# Altium project 3PH-ACIM-DRIVER.PrjPcb
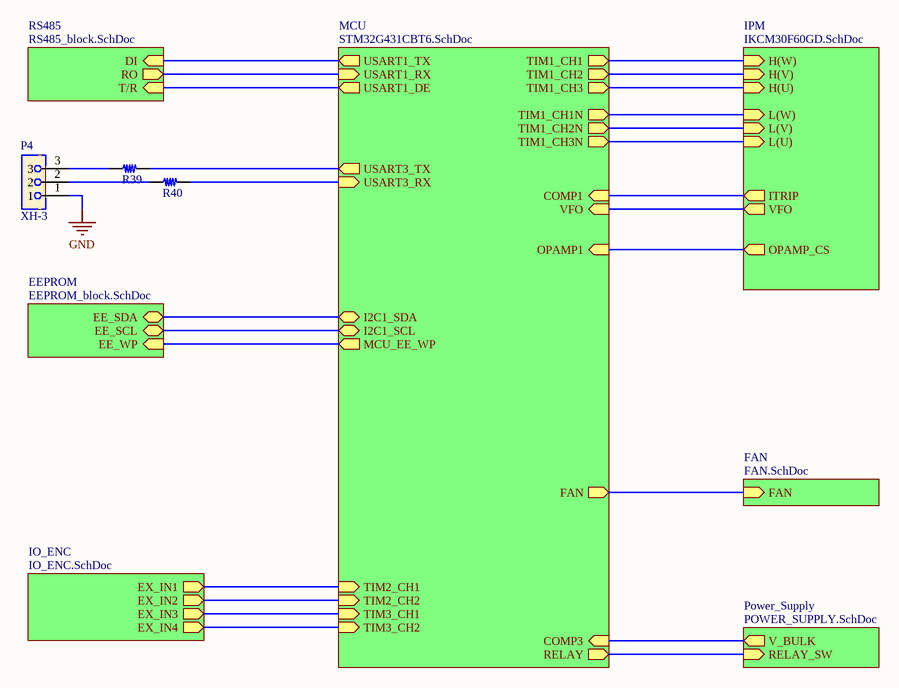
[diagram p0: MAIN.SchDoc]
8 sheets, 175 parts. Net scope: hierarchical (ports join the sheet entries above them; power ports are global).
Board file: 3PH-ACIM-DRIVER.PcbDoc
Sheets:
  MAIN.SchDoc
    IPM = IKCM30F60GD.SchDoc
    MCU = STM32G431CBT6.SchDoc
    Power_Supply = POWER_SUPPLY.SchDoc
    RS485 = RS485_block.SchDoc
    EEPROM = EEPROM_block.SchDoc
    FAN = FAN.SchDoc
    IO_ENC = IO_ENC.SchDoc

## Sheet MAIN.SchDoc
size 381 x 254 mm; SheetNumber: 1; SheetTotal: 8

### Parts
P4  XH-3  [XH-3]
R39  RES_SMD  [R 0603]  (value not drawn)
R40  RES_SMD  [R 0603]  (value not drawn)

### Sub-sheets
EEPROM = EEPROM_block.SchDoc: EE_SDA (bidir), EE_SCL (bidir), EE_WP (in)
FAN = FAN.SchDoc: FAN (in)
IO_ENC = IO_ENC.SchDoc: EX_IN1 (out), EX_IN2 (out), EX_IN3 (out), EX_IN4 (out)
IPM = IKCM30F60GD.SchDoc: H(U) (in), H(V) (in), H(W) (in), L(U) (in), L(V) (in), L(W) (in), VFO (out), OPAMP_CS (out), ITRIP (out)
MCU = STM32G431CBT6.SchDoc: TIM1_CH1 (out), TIM1_CH2 (out), TIM1_CH3 (out), TIM1_CH1N (out), TIM1_CH2N (out), TIM1_CH3N (out), USART1_TX (out), USART1_RX (in), VFO (in), COMP3 (in), OPAMP1 (in), RELAY (out), I2C1_SDA (bidir), I2C1_SCL (bidir), USART1_DE (out), TIM3_CH1 (in), TIM3_CH2 (in), TIM2_CH2 (in), TIM2_CH1 (in), FAN (out), MCU_EE_WP (out), COMP1 (in), USART3_TX (out), USART3_RX (in)
Power_Supply = POWER_SUPPLY.SchDoc: V_BULK (out), RELAY_SW (in)
RS485 = RS485_block.SchDoc: RO (out), DI (in), T/R (in)

### Nets
GND: P4.1
ITRIP: sheet IPM/ITRIP, sheet MCU/COMP1
SERIAL_N: sheet MCU/USART1_TX, sheet RS485/DI
SERIAL_P: sheet MCU/USART1_RX, sheet RS485/RO
NetC3_2: sheet IPM/OPAMP_CS, sheet MCU/OPAMP1
NetC19_2: sheet IPM/VFO, sheet MCU/VFO
NetC32_2: sheet MCU/COMP3, sheet Power_Supply/V_BULK
NetD6_1: sheet MCU/RELAY, sheet Power_Supply/RELAY_SW
NetD20_1: sheet MCU/FAN, sheet FAN/FAN
NetP4_2: P4.2 R40.1
NetP4_3: P4.3 R39.1
NetR12_1: sheet IPM/H(U), sheet MCU/TIM1_CH3
NetR13_1: sheet IPM/H(V), sheet MCU/TIM1_CH2
NetR14_1: sheet IPM/H(W), sheet MCU/TIM1_CH1
NetR15_1: sheet IPM/L(U), sheet MCU/TIM1_CH3N
NetR16_1: sheet IPM/L(V), sheet MCU/TIM1_CH2N
NetR17_1: sheet IPM/L(W), sheet MCU/TIM1_CH1N
NetR39_2: R39.2 ; sheet MCU/USART3_TX
NetR40_2: R40.2 ; sheet MCU/USART3_RX
NetR48_1: sheet MCU/USART1_DE, sheet RS485/T/R
NetR53_1: sheet MCU/MCU_EE_WP, sheet EEPROM/EE_WP
NetR54_1: sheet MCU/I2C1_SDA, sheet EEPROM/EE_SDA
NetR55_1: sheet MCU/I2C1_SCL, sheet EEPROM/EE_SCL
NetR62_1: sheet MCU/TIM2_CH1, sheet IO_ENC/EX_IN1
NetR65_1: sheet MCU/TIM2_CH2, sheet IO_ENC/EX_IN2
NetR66_1: sheet MCU/TIM3_CH1, sheet IO_ENC/EX_IN3
NetR69_1: sheet MCU/TIM3_CH2, sheet IO_ENC/EX_IN4

## Sheet IKCM30F60GD.SchDoc
size 762 x 381 mm; SheetNumber: 2; SheetTotal: 8
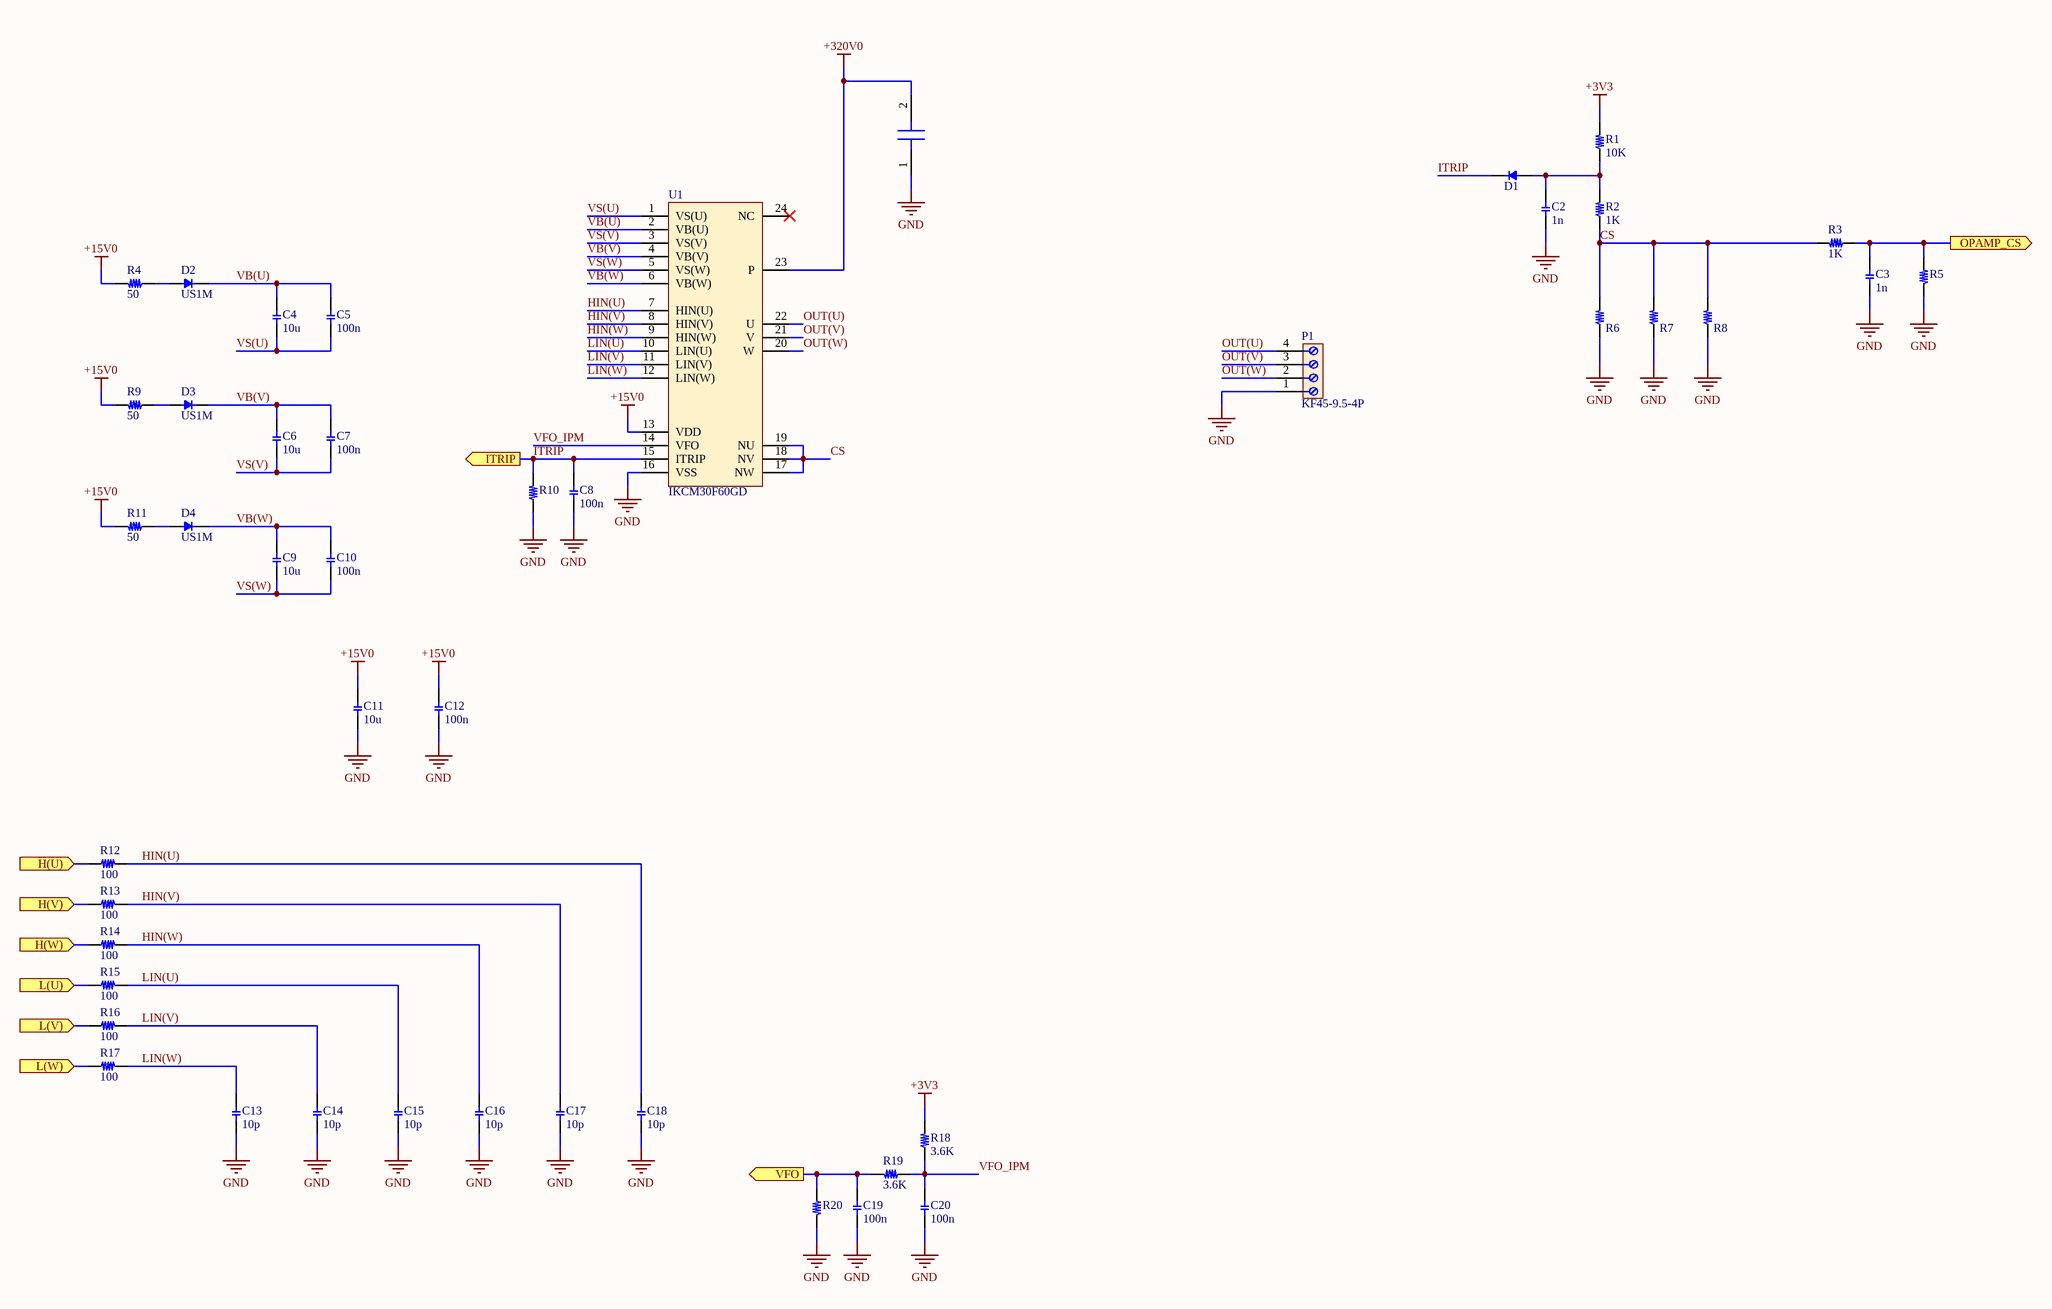
[diagram p1: IKCM30F60GD.SchDoc]

### Parts
C1  CAP  [C FILM 15mm]  (value not drawn)
C2  1n  [C 0603]
C3  1n  [C 0603]
C4  10u  [C 0603]
C5  100n  [C 0603]
C6  10u  [C 0603]
C7  100n  [C 0603]
C8  100n  [C 0603]
C9  10u  [C 0603]
C10  100n  [C 0603]
C11  10u  [C 0603]
C12  100n  [C 0603]
C13  10p  [C 0603]
C14  10p  [C 0603]
C15  10p  [C 0603]
C16  10p  [C 0603]
C17  10p  [C 0603]
C18  10p  [C 0603]
C19  100n  [C 0603]
C20  100n  [C 0603]
D1  DIOD_SMD  [D SOD-323]  (value not drawn)
D2  US1M  [DIOD_SMA]
D3  US1M  [DIOD_SMA]
D4  US1M  [DIOD_SMA]
P1  KF45-9.5-4P  [DG45C-B-04P-13]
R1  10K  [R 0603]
R2  1K  [R 0603]
R3  1K  [R 0603]
R4  50  [R 1206]
R5  1K  [R 0603]  (value not drawn)
R6  RES_SMD  [R 2512]  (value not drawn)
R7  RES_SMD  [R 2512]  (value not drawn)
R8  RES_SMD  [R 2512]  (value not drawn)
R9  50  [R 1206]
R10  1K  [R 0603]  (value not drawn)
R11  50  [R 1206]
R12  100  [R 0603]
R13  100  [R 0603]
R14  100  [R 0603]
R15  100  [R 0603]
R16  100  [R 0603]
R17  100  [R 0603]
R18  3.6K  [R 0603]
R19  3.6K  [R 0603]
R20  3.6K  [R 0603]  (value not drawn)
U1  IKCM30F60GD  [INF-CIPOS MINI]

### Ports
H(U) (in), H(V) (in), H(W) (in), ITRIP (out), L(U) (in), L(V) (in), L(W) (in), OPAMP_CS (out), VFO (out)

### Nets
+3V3: R1.2 R18.2
+15V0: C11.2 C12.2 R4.2 R9.2 R11.2 U1.13(VDD)
+320V0: C1.2 U1.23(P)
GND: C1.1 C2.1 C3.1 C8.1 C11.1 C12.1 C13.1 C14.1 C15.1 C16.1 C17.1 C18.1 C19.1 C20.1 P1.1 R5.2 R6.1 R7.1 R8.1 R10.1 R20.2 U1.16(VSS)
CS: R2.1 R3.2 R6.2 R7.2 R8.2 U1.17(NW) U1.18(NV) U1.19(NU)
HIN(U): C18.2 R12.2 U1.7(HIN(U))
HIN(V): C17.2 R13.2 U1.8(HIN(V))
HIN(W): C16.2 R14.2 U1.9(HIN(W))
ITRIP: C8.2 D1.2 R10.2 U1.15(ITRIP) ; port ITRIP
LIN(U): C15.2 R15.2 U1.10(LIN(U))
LIN(V): C14.2 R16.2 U1.11(LIN(V))
LIN(W): C13.2 R17.2 U1.12(LIN(W))
OUT(U): P1.4 U1.22(U)
OUT(V): P1.3 U1.21(V)
OUT(W): P1.2 U1.20(W)
VB(U): C4.2 C5.2 D2.2 U1.2(VB(U))
VB(V): C6.2 C7.2 D3.2 U1.4(VB(V))
VB(W): C9.2 C10.2 D4.2 U1.6(VB(W))
VFO_IPM: C20.2 R18.1 R19.1 U1.14(VFO)
VS(U): C4.1 C5.1 U1.1(VS(U))
VS(V): C6.1 C7.1 U1.3(VS(V))
VS(W): C9.1 C10.1 U1.5(VS(W))
NetC2_2: C2.2 D1.1 R1.1 R2.2
NetC3_2: C3.2 R3.1 R5.1 ; port OPAMP_CS
NetC19_2: C19.2 R19.2 R20.1 ; port VFO
NetD2_1: D2.1 R4.1
NetD3_1: D3.1 R9.1
NetD4_1: D4.1 R11.1
NetR12_1: R12.1 ; port H(U)
NetR13_1: R13.1 ; port H(V)
NetR14_1: R14.1 ; port H(W)
NetR15_1: R15.1 ; port L(U)
NetR16_1: R16.1 ; port L(V)
NetR17_1: R17.1 ; port L(W)

Not connected (* = marked no-connect by the designer): U1 24(NC)*

### Library data of the parts
C2-C20 = CAP_SMD
D2-D4 = DIOD_SMD
R1-R5 R9-R20 = RES_SMD

## Sheet STM32G431CBT6.SchDoc
size 762 x 381 mm; SheetNumber: 4; SheetTotal: 8
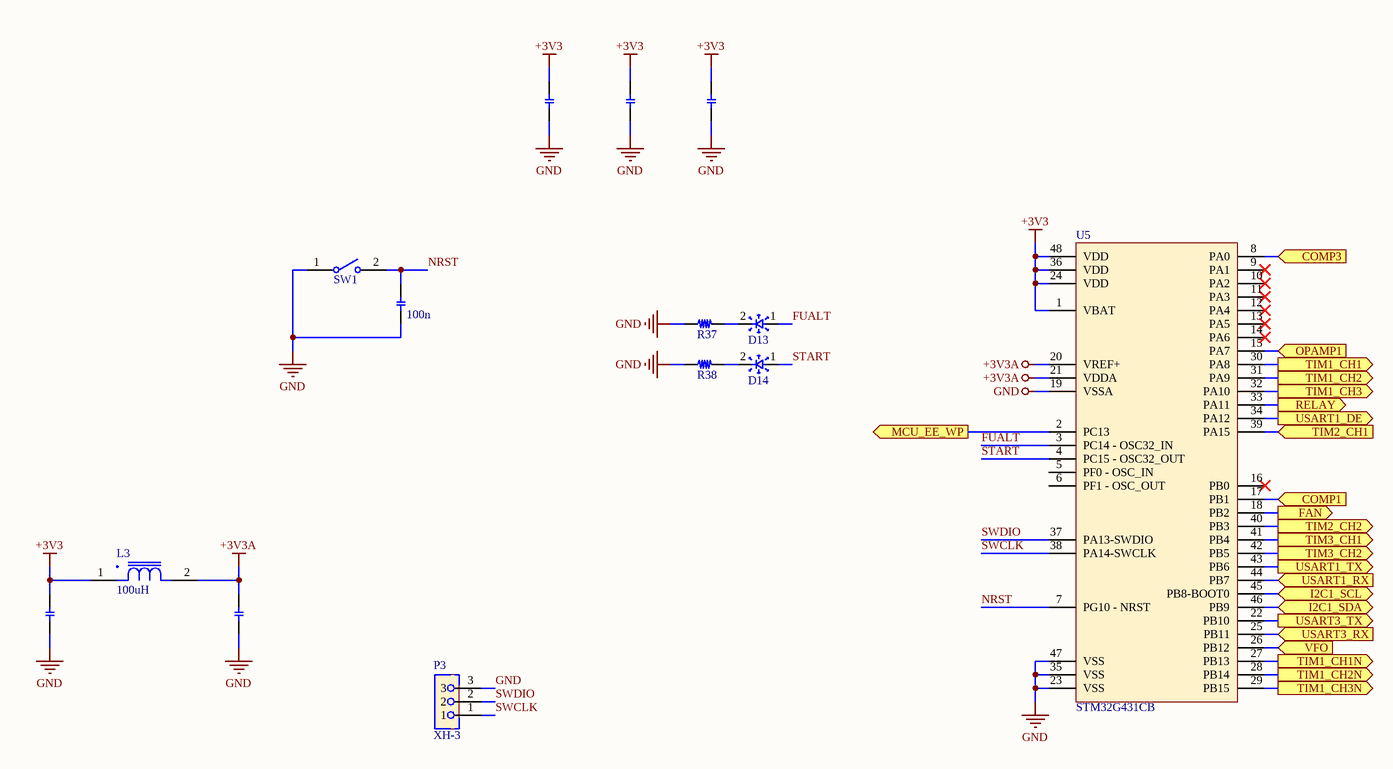
[diagram p2: STM32G431CBT6.SchDoc]

### Parts
C40  CAP_SMD  [C 0603]  (value not drawn)
C41  CAP_SMD  [C 0603]  (value not drawn)
C42  CAP_SMD  [C 0603]  (value not drawn)
C43  100n  [C 0603]
C44  CAP_SMD  [C 0603]  (value not drawn)
C45  CAP_SMD  [C 0603]  (value not drawn)
D13  LED_SMD  [D 0603]  (value not drawn)
D14  LED_SMD  [D 0603]  (value not drawn)
L3  100uH  [L 0805]
P3  XH-3  [XH-3]
R37  RES_SMD  [R 0603]  (value not drawn)
R38  RES_SMD  [R 0603]  (value not drawn)
SW1  434121043836  [WS-TASV_L6W3.5H4.3_4341x10438x6]  (value not drawn)
U5  STM32G431CB  [QFP-48]

### Ports
COMP1 (in), COMP3 (in), FAN (out), I2C1_SCL (bidir), I2C1_SDA (bidir), MCU_EE_WP (out), OPAMP1 (in), RELAY (out), TIM1_CH1 (out), TIM1_CH1N (out), TIM1_CH2 (out), TIM1_CH2N (out), TIM1_CH3 (out), TIM1_CH3N (out), TIM2_CH1 (in), TIM2_CH2 (out), TIM3_CH1 (out), TIM3_CH2 (out), USART1_DE (out), USART1_RX (in), USART1_TX (out), USART3_RX (in), USART3_TX (out), VFO (in)

### Nets
+3V3: C40.2 C41.2 C42.2 C44.2 L3.1 U5.1(VBAT) U5.24(VDD) U5.36(VDD) U5.48(VDD)
+3V3A: C45.2 L3.2 U5.20(VREF+) U5.21(VDDA)
GND: C40.1 C41.1 C42.1 C43.1 C44.1 C45.1 P3.3 R37.1 R38.1 SW1.1 U5.19(VSSA) U5.23(VSS) U5.35(VSS) U5.47(VSS)
FUALT: D13.1 U5.3(PC14_-_OSC32_IN)
ITRIP: U5.17(PB1) ; port COMP1
NRST: C43.2 SW1.2 U5.7(PG10_-_NRST)
SERIAL_N: U5.43(PB6) ; port USART1_TX
SERIAL_P: U5.44(PB7) ; port USART1_RX
START: D14.1 U5.4(PC15_-_OSC32_OUT)
SWCLK: P3.1 U5.38(PA14-SWCLK)
SWDIO: P3.2 U5.37(PA13-SWDIO)
NetC3_2: U5.15(PA7) ; port OPAMP1
NetC19_2: U5.26(PB12) ; port VFO
NetC32_2: U5.8(PA0) ; port COMP3
NetD6_1: U5.33(PA11) ; port RELAY
NetD13_2: D13.2 R37.2
NetD14_2: D14.2 R38.2
NetD20_1: U5.18(PB2) ; port FAN
NetR12_1: U5.32(PA10) ; port TIM1_CH3
NetR13_1: U5.31(PA9) ; port TIM1_CH2
NetR14_1: U5.30(PA8) ; port TIM1_CH1
NetR15_1: U5.29(PB15) ; port TIM1_CH3N
NetR16_1: U5.28(PB14) ; port TIM1_CH2N
NetR17_1: U5.27(PB13) ; port TIM1_CH1N
NetR39_2: U5.22(PB10) ; port USART3_TX
NetR40_2: U5.25(PB11) ; port USART3_RX
NetR48_1: U5.34(PA12) ; port USART1_DE
NetR53_1: U5.2(PC13) ; port MCU_EE_WP
NetR54_1: U5.46(PB9) ; port I2C1_SDA
NetR55_1: U5.45(PB8-BOOT0) ; port I2C1_SCL
NetR62_1: U5.39(PA15) ; port TIM2_CH1
NetR65_1: U5.40(PB3) ; port TIM2_CH2
NetR66_1: U5.41(PB4) ; port TIM3_CH1
NetR69_1: U5.42(PB5) ; port TIM3_CH2

Not connected (* = marked no-connect by the designer): U5 5(PF0_-_OSC_IN) 6(PF1_-_OSC_OUT) 9(PA1)* 10(PA2)* 11(PA3)* 12(PA4)* 13(PA5)* 14(PA6)* 16(PB0)*

### Library data of the parts
C43 = CAP_SMD
L3 = Inductor
SW1 = 434121043836: WS-TASV SMT Tact Switch, L6 x W3.5 x H4.3mm, 360g, SPST-NO, 12V, 50mA; Manufacturer: Wurth Elektronik; Washable: No; Manufacturer Part Number: 434121043836; Category: Tact Switches; Match Code: WS-TASV; ComponentLink1Description: Website Link; ComponentLink1URL: https://www.we-online.com/redexpert/article/434121043836?ad; ComponentLink2Description: Datasheet Link; ComponentLink2URL: https://www.we-online.com/redexpert/spec/434121043836?ad; Mount: Surface Mount; Operating Temperature Max: 85°C; Operating Temperature Min: -40°C; Packaging: Tape and Reel; Length: 6mm; Width: 3.5mm; Height: 4.3mm; Circuit: SPST-NO; Contact Material: Stainless Steel; Contact Plating: Silver; Operation Force: 360g; Rated Current: 50mA; Rated Voltage (DC): 12V; Terminal Material: Copper Alloy; Terminal Plating: Silver

## Sheet POWER_SUPPLY.SchDoc
size 762 x 381 mm; SheetNumber: 3; SheetTotal: 8; SPICEModelCacheBEUKSOBP: <root> / <DocumentId>BEUKSOBP</DocumentId> / <CacheFrame Number="0"> / <Model Name="865230657013_100uf" Kind="CKT"> / <Text>******* / .subckt 865230657013_100uF 1 2 / Rser 1 3 0.189 / Lser 2 4 5.72884434804354E-09 / C1 3 4 0.0001 / Rpar 3 4 1000000 / .ends 865230657013_100uF</Text> / </Model> / <Model Name="861011483001_47uf" Kind="CKT"> / <Text>***** / .subckt 861011483001_47uF 1 2 / Rser 1 3 0.592 / Lser 2 4 1.3511713379E-08 / C1 3 4 0.000047 / Rpar 3 4 1063829.78723404 / .ends 861011483001_47uF</Text> / </Model> / <Model Name="861011386030_0.47mf" Kind="CKT"> / <Text>***** / .subckt 861011386030_0.47mF 1 2 / Rser 1 3 0.17265 / Lser 2 4 1.3520559628E-08 / C1 3 4 0.00047 / Rpar 3 4 106382.978723404 / .ends 861011386030_0.47mF</Text> / </Model> / <Model Name="861011486024_0.47mf" Kind="CKT"> / <Text>***** / .subckt 861011486024_0.47mF 1 2 / Rser 1 3 0.076 / Lser 2 4 9.10992922174604E-09 / C1 3 4 0.00047 / Rpar 3 4 106382.978723404 / .ends 861011486024_0.47mF</Text> / </Model> / <Model Name="860241478003_10uf" Kind="CKT"> / <Text>******* / .subckt 860241478003_10uF 1 2 / Rser 1 3 1.01763676485 / Lser 2 4 9.918160074E-09 / C1 3 4 0.00001 / Rpar 3 4 10000000 / .ends 860241478003_10uF</Text> / </Model> / <Model Name="860240578009_330uf" Kind="CKT"> / <Text>******* / .subckt 860240578009_330uF 1 2 / Rser 1 3 0.092 / Lser 2 4 0.000000007 / C1 3 4 0.00033 / Rpar 3 4 303030.303030303 / .ends 860240578009_330uF</Text> / </Model> / <Model Name="875075661010_330uf" Kind="CKT"> / <Text>******* / .subckt 875075661010_330uF 1 2 / Rser 1 3 0.0146833185075 / Lser 2 4 5.45495338E-09 / C1 3 4 0.00033 / Rpar 3 4 15151.5151515152 / .ends 875075661010_330uF</Text> / </Model> / <Model Name="861011384014_0.22mf" Kind="CKT"> / <Text>***** / .subckt 861011384014_0.22mF 1 2 / Rser 1 3 0.31844 / Lser 2 4 1.4863233484E-08 / C1 3 4 0.00022 / Rpar 3 4 227272.727272727 / .ends 861011384014_0.22mF</Text> / </Model> / <Model Name="865080657018_220uf" Kind="CKT"> / <Text>******* / .subckt 865080657018_220uF 1 2 / Rser 1 3 0.154 / Lser 2 4 2.1311583677206E-08 / C1 3 4 0.00022 / Rpar 3 4 454545.454545455 / .ends 865080657018_220uF</Text> / </Model> / </CacheFrame> / </root>
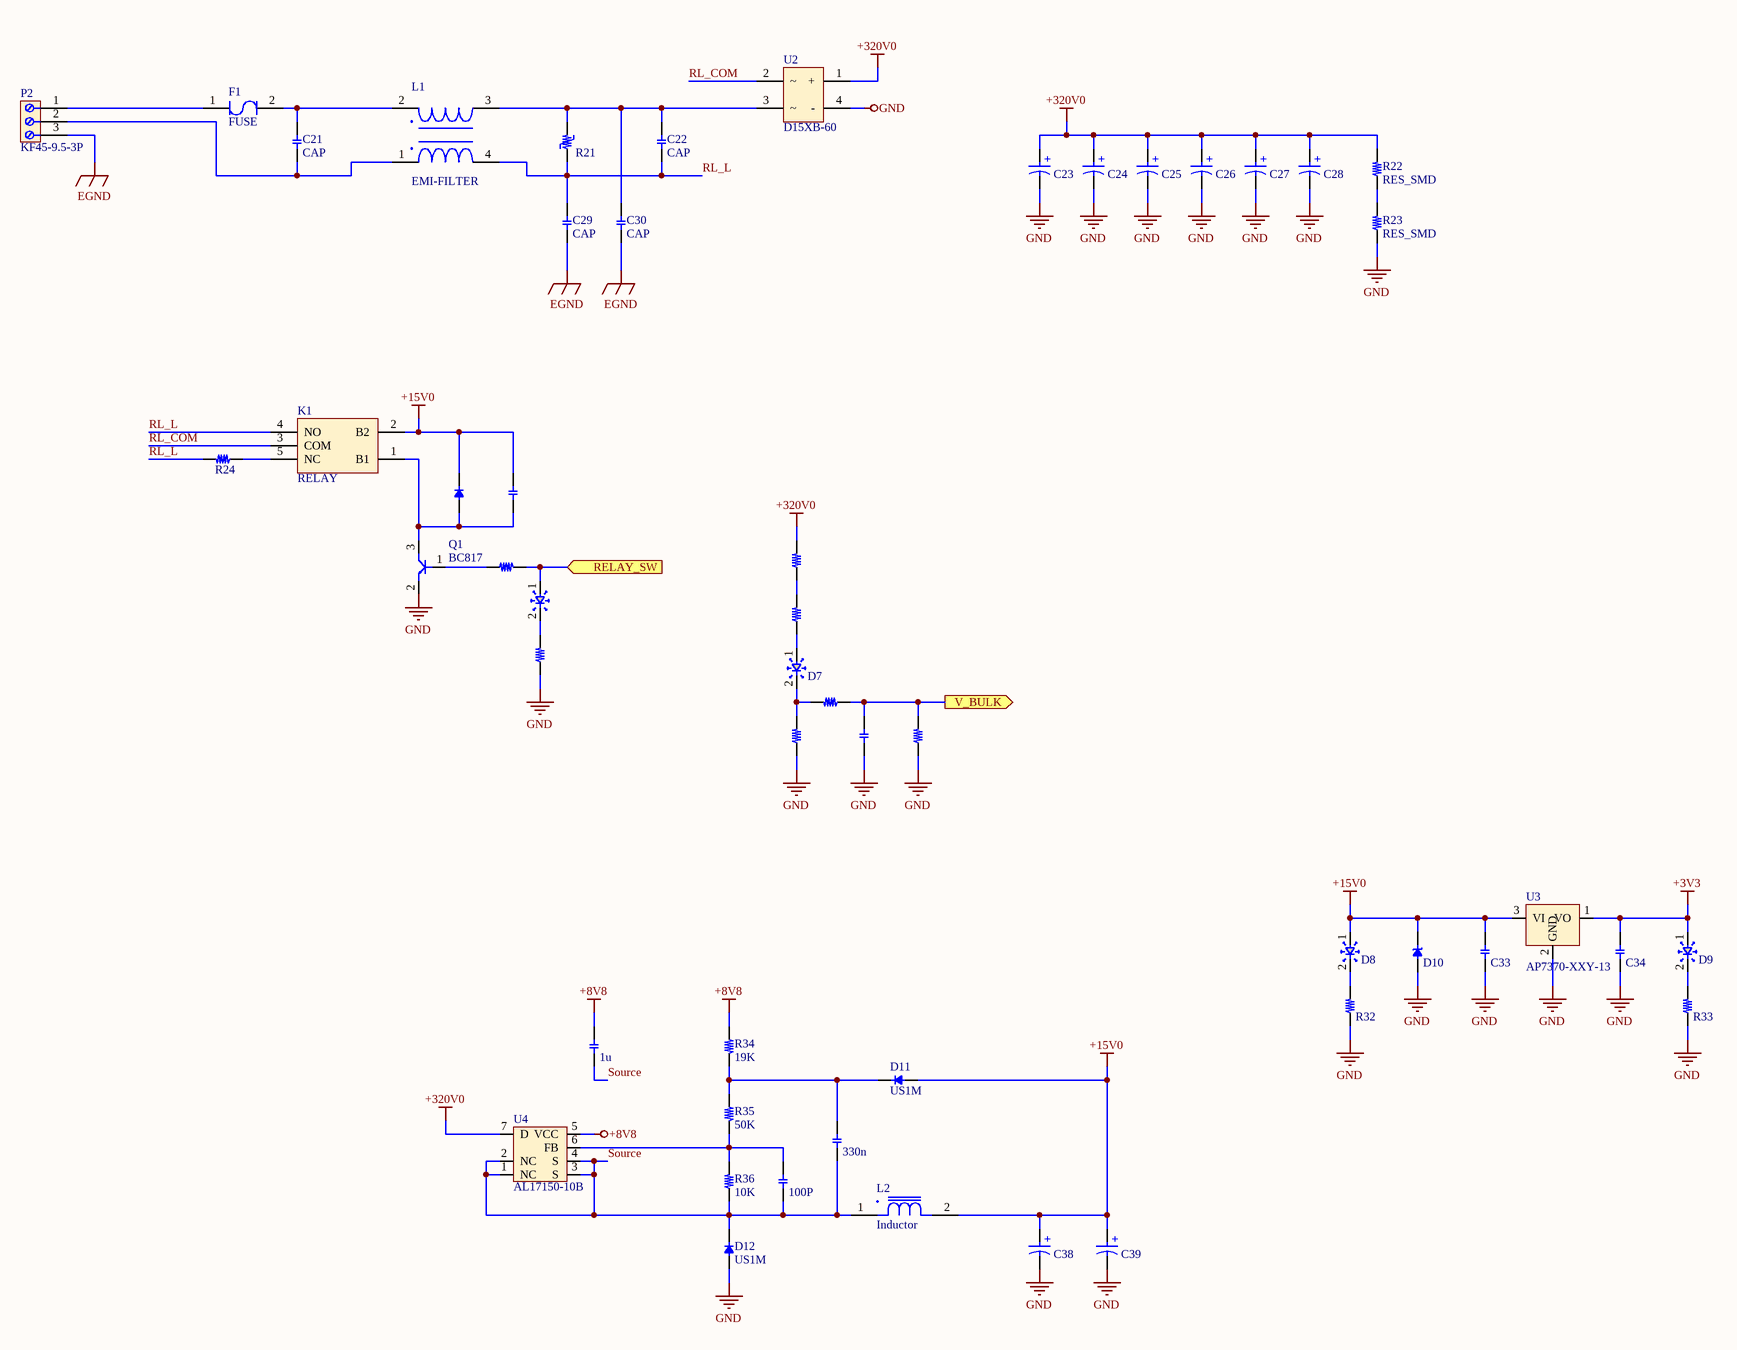
[diagram p3: POWER_SUPPLY.SchDoc]

### Parts
C21  CAP  [C FILM 15mm]
C22  CAP  [C FILM 15mm]
C23  220µF  [WCAP-AIG8_D25H30]  (value not drawn)
C24  220µF  [WCAP-AIG8_D25H30]  (value not drawn)
C25  220µF  [WCAP-AIG8_D25H30]  (value not drawn)
C26  220µF  [WCAP-AIG8_D25H30]  (value not drawn)
C27  220µF  [WCAP-AIG8_D25H30]  (value not drawn)
C28  220µF  [WCAP-AIG8_D25H30]  (value not drawn)
C29  CAP  [CXY]
C30  CAP  [CXY]
C31  CAP_SMD  [C 0603]  (value not drawn)
C32  CAP_SMD  [C 1206]  (value not drawn)
C33  CAP_SMD  [C 0603]  (value not drawn)
C34  CAP_SMD  [C 0603]  (value not drawn)
C35  1u  [C 1206]
C36  330n  [C 1206]
C37  100P  [C 1206]
C38  220uF  [WCAP-ASLI_D10H10.5]  (value not drawn)
C39  220uF  [WCAP-ASLI_D10H10.5]  (value not drawn)
D5  DIOD_SMD  [D SOD-323]  (value not drawn)
D6  LED_SMD  [D 0603]  (value not drawn)
D7  LED_SMD  [D 1206]  (value not drawn)
D8  LED_SMD  [D 0603]  (value not drawn)
D9  LED_SMD  [D 0603]  (value not drawn)
D10  TVS_UI  [D SOD-123]  (value not drawn)
D11  US1M  [DIOD_SMA]
D12  US1M  [DIOD_SMA]
F1  FUSE  [FUSE 1]
K1  RELAY  [ALQ124]
L1  EMI-FILTER  [EMI-FILTER-10*13]
L2  Inductor  [L_10*10_SMD]
P2  KF45-9.5-3P  [DG45C-B-03P-13]
Q1  BC817  [SOT-23_3_Q]
R21  VARISTOR  [RTD]  (value not drawn)
R22  RES_SMD  [R 2512]
R23  RES_SMD  [R 2512]
R24  RES_THD  [R 5W VER]  (value not drawn)
R25  RES_SMD  [R 1206]  (value not drawn)
R26  RES_SMD  [R 0603]  (value not drawn)
R27  RES_SMD  [R 1206]  (value not drawn)
R28  RES_SMD  [R 0603]  (value not drawn)
R29  RES_SMD  [R 1206]  (value not drawn)
R30  RES_SMD  [R 1206]  (value not drawn)
R31  RES_SMD  [R 0603]  (value not drawn)
R32  RES_SMD  [R 0603]  (value not drawn)
R33  RES_SMD  [R 0603]  (value not drawn)
R34  19K  [R 1206]
R35  50K  [R 1206]
R36  10K  [R 1206]
U2  D15XB-60  [D15XB-60]
U3  AP7370-XXY-13  [SOT89-U]
U4  AL17150-10B  [SOIC-7]

### Ports
RELAY_SW (in), V_BULK (out)

### Nets
+3V3: C34.2 D9.1 U3.1(VO)
+8V8: C35.2 R34.1 U4.5(VCC)
+15V0: C31.2 C33.2 C38.1(P) C39.1(P) D5.2 D8.1 D10.2 D11.1 K1.2(B2) L2.2 U3.3(VI)
+320V0: C23.1(P) C24.1(P) C25.1(P) C26.1(P) C27.1(P) C28.1(P) R22.2 R25.2 U2.1(+) U4.7(D)
EGND: C29.1 C30.1 P2.3
GND: C23.2(N) C24.2(N) C25.2(N) C26.2(N) C27.2(N) C28.2(N) C32.1 C33.1 C34.1 C38.2(N) C39.2(N) D10.1 D12.1 Q1.2(E) R23.1 R28.1 R30.1 R31.1 R32.1 R33.1 U2.4(-) U3.2(GND)
RL_COM: K1.3(COM) U2.2
RL_L: C22.1 C29.2 K1.4(NO) L1.4 R21.1 R24.2
Source: C35.1 C36.1 C37.1 D12.2 L2.1 R36.1 U4.1(NC) U4.2(NC) U4.3(S) U4.4(S)
NetC21_1: C21.1 L1.1 P2.2
NetC21_2: C21.2 F1.2 L1.2
NetC22_2: C22.2 C30.2 L1.3 R21.2 U2.3
NetC31_1: C31.1 D5.1 K1.1(B1) Q1.3(C)
NetC32_2: C32.2 R29.1 R31.2 ; port V_BULK
NetC36_2: C36.2 D11.2 R34.2 R35.1
NetC37_2: C37.2 R35.2 R36.2 U4.6(FB)
NetD6_1: D6.1 R26.2 ; port RELAY_SW
NetD6_2: D6.2 R28.2
NetD7_1: D7.1 R27.1
NetD7_2: D7.2 R29.2 R30.2
NetD8_2: D8.2 R32.2
NetD9_2: D9.2 R33.2
NetF1_1: F1.1 P2.1
NetK1_5: K1.5(NC) R24.1
NetQ1_1: Q1.1(B) R26.1
NetR22_1: R22.1 R23.2
NetR25_1: R25.1 R27.2

### Notes on the sheet
- (in symbol 861011384014) +
- (in symbol 865080657018) +

### Library data of the parts
C23-C28 = 861011384014: WCAP-AIG8 Aluminum Electrolytic Capacitor, Snap-In, D25 x H30mm, 220µF, 400V; Manufacturer: Wurth Elektronik; Capacitance Tolerance: +/-20%; Dissipation Factor: 20%; Endurance: 2000h; Leakage Current: 1760µA; Ripple Current: 1550mA; Technical Reference: ANAO300221M400DSIC3B000; Manufacturer Part Number: 861011384014; Category: Aluminum Electrolytic Capacitors; Match Code: WCAP-AIG8; ComponentLink1Description: Website Link; ComponentLink1URL: https://www.we-online.com/redexpert/article/861011384014?ad; ComponentLink2Description: Datasheet Link; ComponentLink2URL: https://www.we-online.com/redexpert/spec/861011384014?ad; Mount: Through Hole; Operating Temperature Max: 85°C; Operating Temperature Min: -25°C; Packaging: Tray; Height: 30mm; Diameter: 25mm; Capacitance: 220µF; Rated Voltage (DC): 400V
C35-C37 = CAP_SMD
C38 C39 = 865080657018: WCAP-ASLI Aluminum Electrolytic Capacitor, V-Chip, D10 x H10.5mm, 220uF, 50V; Manufacturer: Wurth Elektronik; Capacitance Tolerance: +/-20%; Dissipation Factor: 12%; Endurance: 2000h; Leakage Current: 110uA; Ripple Current: 650mA; Technical Reference: ASEF105221M050DVCTEB000; Manufacturer Part Number: 865080657018; Category: Aluminum Electrolytic Capacitors; Match Code: WCAP-ASLI; ComponentLink1Description: Website Link; ComponentLink1URL: https://www.we-online.com/redexpert/article/865080657018?ad; ComponentLink2Description: Datasheet Link; ComponentLink2URL: https://www.we-online.com/redexpert/spec/865080657018?ad; Mount: Surface Mount; Operating Temperature Max: 105°C; Operating Temperature Min: -55°C; Packaging: Tape and Reel; Height: 10.5mm; Diameter: 10mm; Capacitance: 220uF; Rated Voltage (DC): 50V
D10 = DIOD_SMD_TVS_UI
D11 D12 = DIOD_SMD
R34-R36 = RES_SMD

## Sheet RS485_block.SchDoc
size 635 x 381 mm; SheetNumber: 5; SheetTotal: 8
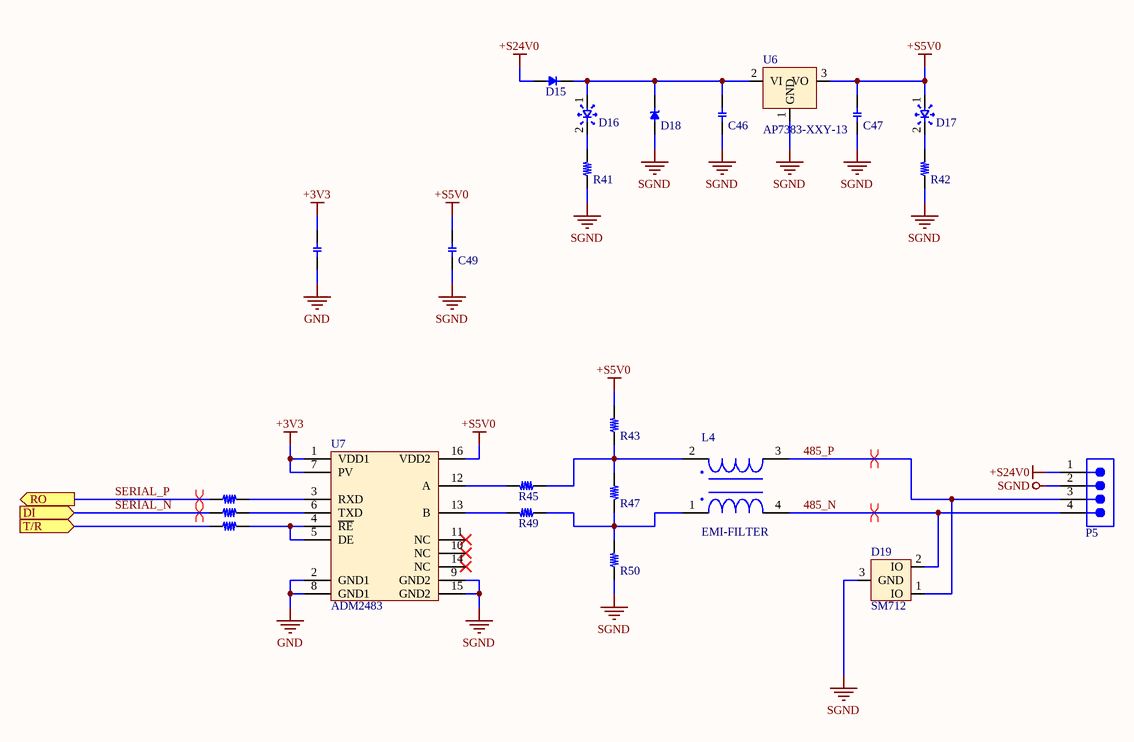
[diagram p4: RS485_block.SchDoc]

### Parts
C46  CAP_SMD  [C 0603]  (value not drawn)
C47  CAP_SMD  [C 0603]  (value not drawn)
C48  CAP_SMD  [C 0603]  (value not drawn)
C49  CAP_SMD  [C 0603]  (value not drawn)
D15  DIOD_SMD  [DIOD_SMA]  (value not drawn)
D16  LED_SMD  [D 0603]  (value not drawn)
D17  LED_SMD  [D 0603]  (value not drawn)
D18  TVS_UI  [DIOD_SMB]  (value not drawn)
D19  SM712  [SOT-23_3_D]
L4  EMI-FILTER  [EMI-FILTER-1206]
P5  691321300004  [691321300004]  (value not drawn)
R41  RES_SMD  [R 0603]  (value not drawn)
R42  RES_SMD  [R 0603]  (value not drawn)
R43  RES_SMD  [R 1206]  (value not drawn)
R44  RES_SMD  [R 0603]  (value not drawn)
R45  RES_SMD  [R 1206]  (value not drawn)
R46  RES_SMD  [R 0603]  (value not drawn)
R47  RES_SMD  [R 1206]  (value not drawn)
R48  RES_SMD  [R 0603]  (value not drawn)
R49  RES_SMD  [R 1206]  (value not drawn)
R50  RES_SMD  [R 1206]  (value not drawn)
U6  AP7383-XXY-13  [SOT89-U]
U7  ADM2483  [SOIC-16-WIDE]

### Ports
DI (in), RO (out), T/R (in)

### Nets
+3V3: C48.2 U7.1(VDD1) U7.7(PV)
+S5V0: C47.2 C49.2 D17.1 R43.2 U6.3(VO) U7.16(VDD2)
+S24V0: D15.1 P5.1
GND: C48.1 U7.2(GND1) U7.8(GND1)
SGND: C46.1 C47.1 C49.1 D18.1 D19.3(GND) P5.2 R41.1 R42.1 R50.1 U6.1(GND) U7.9(GND2) U7.15(GND2)
485_N: D19.2(IO) L4.4 P5.4
485_P: D19.1(IO) L4.3 P5.3
SERIAL_N: R46.1 ; port DI
SERIAL_P: R44.1 ; port RO
NetC46_2: C46.2 D15.2 D16.1 D18.2 U6.2(VI)
NetD16_2: D16.2 R41.2
NetD17_2: D17.2 R42.2
NetL4_1: L4.1 R47.2 R49.1 R50.2
NetL4_2: L4.2 R43.1 R45.1 R47.1
NetR44_2: R44.2 U7.3(RXD)
NetR45_2: R45.2 U7.12(A)
NetR46_2: R46.2 U7.6(TXD)
NetR48_1: R48.1 ; port T/R
NetR48_2: R48.2 U7.4(~{RE}) U7.5(DE)
NetR49_2: R49.2 U7.13(B)

Not connected (* = marked no-connect by the designer): U7 10(NC)* 11(NC)* 14(NC)*

### Layout directives
differential pair: 485_N, 485_P, SERIAL_N, SERIAL_P

### Library data of the parts
D18 = DIOD_SMD_TVS_UI
P5 = 691321300004: WR-TBL Series 321 Vertical PCB Header, Through Hole, pitch 3.81mm, 4p; Manufacturer: Wurth Elektronik; Pin Number: 4; Rated Current: 10A; Working Voltage: 300V; Modularity: No; ComponentLink1Description: Manufacturer Link; ComponentLink1URL: https://www.we-online.com/redexpert/article/691321300004?ad; ComponentLink2Description: Datasheet; ComponentLink2URL: https://www.we-online.com/redexpert/spec/691321300004?ad; Category: Terminal Blocks; Match Code: WR-TBL; Manufacturer Part Number: 691321300004; Mount: Through Hole; Operating Temperature Max: 105°C; Operating Temperature Min: -40°C; Packaging: Box; Pitch: 3.81mm; Orientation: Vertical; Application: Pluggable; PCB/Cable/Panel: PCB

## Sheet EEPROM_block.SchDoc
size A; SheetNumber: 7; SheetTotal: 8
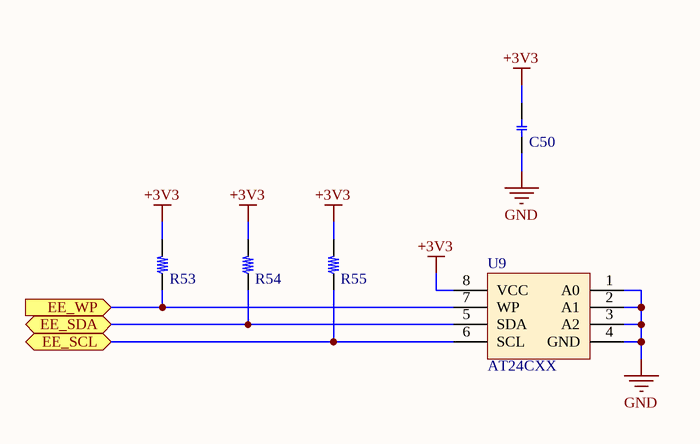
[diagram p5: EEPROM_block.SchDoc]

### Parts
C50  CAP_SMD  [C 0603]  (value not drawn)
R53  RES_SMD  [R 0603]  (value not drawn)
R54  RES_SMD  [R 0603]  (value not drawn)
R55  RES_SMD  [R 0603]  (value not drawn)
U9  AT24CXX  [SOIC-8]

### Ports
EE_SCL (bidir), EE_SDA (bidir), EE_WP (in)

### Nets
+3V3: C50.2 R53.2 R54.2 R55.2 U9.8(VCC)
GND: C50.1 U9.1(A0) U9.2(A1) U9.3(A2) U9.4(GND)
NetR53_1: R53.1 U9.7(WP) ; port EE_WP
NetR54_1: R54.1 U9.5(SDA) ; port EE_SDA
NetR55_1: R55.1 U9.6(SCL) ; port EE_SCL

## Sheet FAN.SchDoc
size A; SheetNumber: 6; SheetTotal: 8
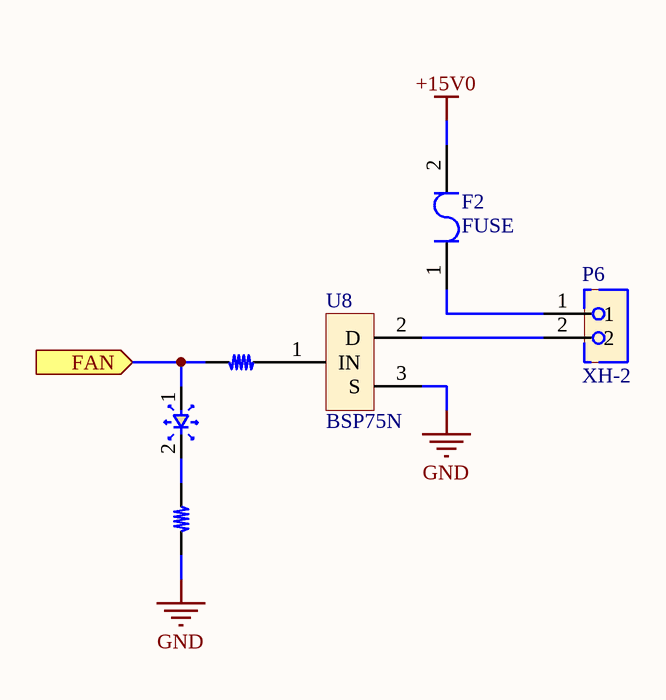
[diagram p6: FAN.SchDoc]

### Parts
D20  LED_SMD  [D 0603]  (value not drawn)
F2  FUSE  [F 1812]
P6  XH-2  [XH-2]
R51  RES_SMD  [R 0603]  (value not drawn)
R52  RES_SMD  [R 0603]  (value not drawn)
U8  BSP75N  [SOT-223 - BSP75N]

### Ports
FAN (in)

### Nets
+15V0: F2.2
GND: R52.2 U8.3(S)
NetD20_1: D20.1 R51.2 ; port FAN
NetD20_2: D20.2 R52.1
NetF2_1: F2.1 P6.1
NetP6_2: P6.2 U8.2(D)
NetR51_1: R51.1 U8.1(IN)

## Sheet IO_ENC.SchDoc
size 381 x 241 mm; SheetNumber: 8; SheetTotal: 8
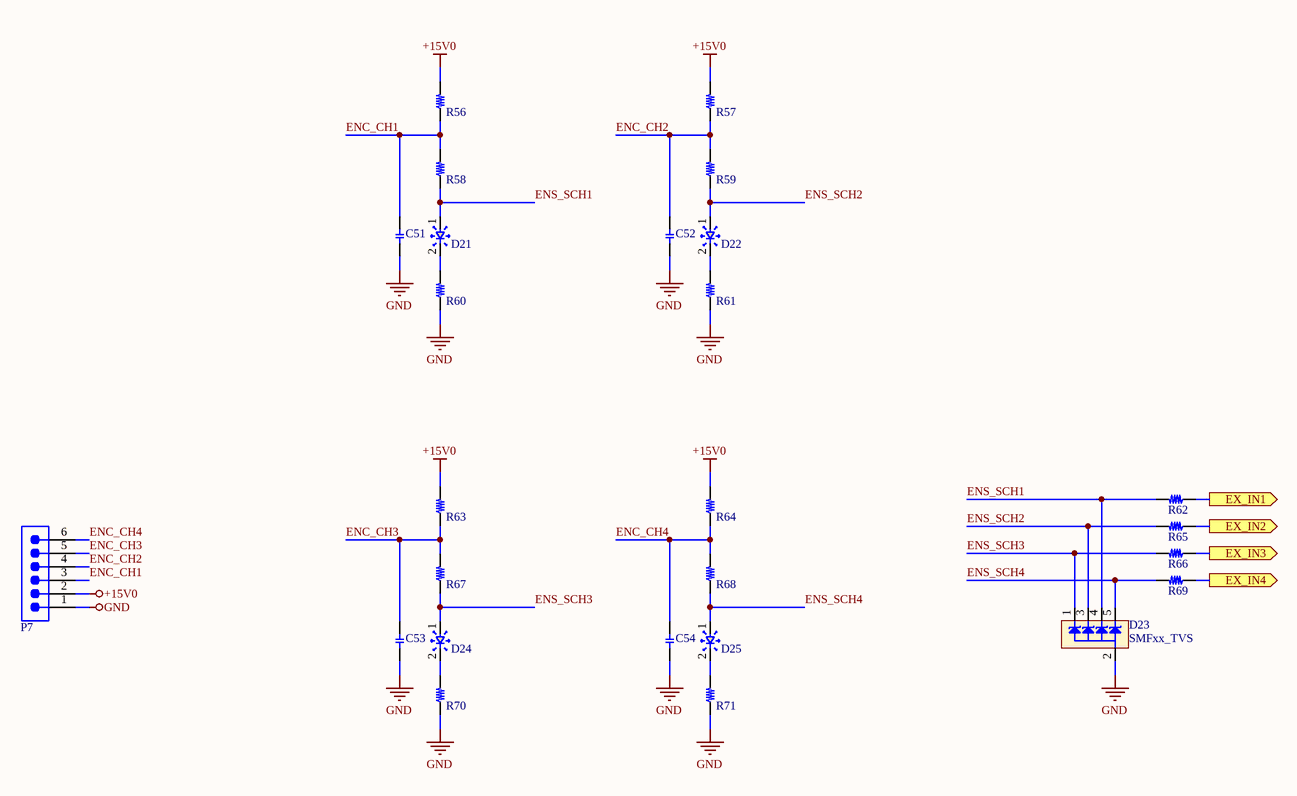
[diagram p7: IO_ENC.SchDoc]

### Parts
C51  CAP_SMD  [C 0603]  (value not drawn)
C52  CAP_SMD  [C 0603]  (value not drawn)
C53  CAP_SMD  [C 0603]  (value not drawn)
C54  CAP_SMD  [C 0603]  (value not drawn)
D21  LED_SMD  [D 0603]  (value not drawn)
D22  LED_SMD  [D 0603]  (value not drawn)
D23  SMFxx_TVS  [SOT353-5]
D24  LED_SMD  [D 0603]  (value not drawn)
D25  LED_SMD  [D 0603]  (value not drawn)
P7  691321300006  [691321300006]  (value not drawn)
R56  RES_SMD  [R 1206]  (value not drawn)
R57  RES_SMD  [R 1206]  (value not drawn)
R58  RES_SMD  [R 0603]  (value not drawn)
R59  RES_SMD  [R 0603]  (value not drawn)
R60  RES_SMD  [R 0603]  (value not drawn)
R61  RES_SMD  [R 0603]  (value not drawn)
R62  RES_SMD  [R 0603]  (value not drawn)
R63  RES_SMD  [R 1206]  (value not drawn)
R64  RES_SMD  [R 1206]  (value not drawn)
R65  RES_SMD  [R 0603]  (value not drawn)
R66  RES_SMD  [R 0603]  (value not drawn)
R67  RES_SMD  [R 0603]  (value not drawn)
R68  RES_SMD  [R 0603]  (value not drawn)
R69  RES_SMD  [R 0603]  (value not drawn)
R70  RES_SMD  [R 0603]  (value not drawn)
R71  RES_SMD  [R 0603]  (value not drawn)

### Ports
EX_IN1 (out), EX_IN2 (out), EX_IN3 (out), EX_IN4 (out)

### Nets
+15V0: P7.2 R56.2 R57.2 R63.2 R64.2
GND: C51.1 C52.1 C53.1 C54.1 D23.2(GND) P7.1 R60.1 R61.1 R70.1 R71.1
ENC_CH1: C51.2 P7.3 R56.1 R58.2
ENC_CH2: C52.2 P7.4 R57.1 R59.2
ENC_CH3: C53.2 P7.5 R63.1 R67.2
ENC_CH4: C54.2 P7.6 R64.1 R68.2
ENS_SCH1: D21.1 D23.4(K3) R58.1 R62.2
ENS_SCH2: D22.1 D23.3(K2) R59.1 R65.2
ENS_SCH3: D23.1(K1) D24.1 R66.2 R67.1
ENS_SCH4: D23.5(K4) D25.1 R68.1 R69.2
NetD21_2: D21.2 R60.2
NetD22_2: D22.2 R61.2
NetD24_2: D24.2 R70.2
NetD25_2: D25.2 R71.2
NetR62_1: R62.1 ; port EX_IN1
NetR65_1: R65.1 ; port EX_IN2
NetR66_1: R66.1 ; port EX_IN3
NetR69_1: R69.1 ; port EX_IN4

### Library data of the parts
P7 = 691321300006: WR-TBL Series 321 Vertical PCB Header, Through Hole, pitch 3.81mm, 6p; Manufacturer: Wurth Elektronik; Pin Number: 6; Rated Current: 10A; Working Voltage: 300V; Modularity: No; ComponentLink1Description: Manufacturer Link; ComponentLink1URL: https://www.we-online.com/redexpert/article/691321300006?ad; ComponentLink2Description: Datasheet; ComponentLink2URL: https://www.we-online.com/redexpert/spec/691321300006?ad; Category: Terminal Blocks; Match Code: WR-TBL; Manufacturer Part Number: 691321300006; Mount: Through Hole; Operating Temperature Max: 105°C; Operating Temperature Min: -40°C; Packaging: Box; Pitch: 3.81mm; Orientation: Vertical; Application: Pluggable; PCB/Cable/Panel: PCB

## Nets that join several sheets
+3V3: IKCM30F60GD (R1.2 R18.2), STM32G431CBT6 (9 pins), POWER_SUPPLY (C34.2 D9.1 U3.1), RS485_block (C48.2 U7.1 U7.7), EEPROM_block (5 pins)
+15V0: IKCM30F60GD (6 pins), POWER_SUPPLY (11 pins), FAN (F2.2), IO_ENC (5 pins)
+320V0: IKCM30F60GD (C1.2 U1.23), POWER_SUPPLY (10 pins)
GND: MAIN (P4.1), IKCM30F60GD (22 pins), STM32G431CBT6 (14 pins), POWER_SUPPLY (22 pins), RS485_block (C48.1 U7.2 U7.8), EEPROM_block (5 pins), FAN (R52.2 U8.3), IO_ENC (10 pins)
ITRIP: IKCM30F60GD (C8.2 D1.2 R10.2 U1.15), STM32G431CBT6 (U5.17)
NetC3_2: IKCM30F60GD (C3.2 R3.1 R5.1), STM32G431CBT6 (U5.15)
NetC19_2: IKCM30F60GD (C19.2 R19.2 R20.1), STM32G431CBT6 (U5.26)
NetC32_2: STM32G431CBT6 (U5.8), POWER_SUPPLY (C32.2 R29.1 R31.2)
NetD6_1: STM32G431CBT6 (U5.33), POWER_SUPPLY (D6.1 R26.2)
NetD20_1: STM32G431CBT6 (U5.18), FAN (D20.1 R51.2)
NetR12_1: IKCM30F60GD (R12.1), STM32G431CBT6 (U5.32)
NetR13_1: IKCM30F60GD (R13.1), STM32G431CBT6 (U5.31)
NetR14_1: IKCM30F60GD (R14.1), STM32G431CBT6 (U5.30)
NetR15_1: IKCM30F60GD (R15.1), STM32G431CBT6 (U5.29)
NetR16_1: IKCM30F60GD (R16.1), STM32G431CBT6 (U5.28)
NetR17_1: IKCM30F60GD (R17.1), STM32G431CBT6 (U5.27)
NetR39_2: MAIN (R39.2), STM32G431CBT6 (U5.22)
NetR40_2: MAIN (R40.2), STM32G431CBT6 (U5.25)
NetR48_1: STM32G431CBT6 (U5.34), RS485_block (R48.1)
NetR53_1: STM32G431CBT6 (U5.2), EEPROM_block (R53.1 U9.7)
NetR54_1: STM32G431CBT6 (U5.46), EEPROM_block (R54.1 U9.5)
NetR55_1: STM32G431CBT6 (U5.45), EEPROM_block (R55.1 U9.6)
NetR62_1: STM32G431CBT6 (U5.39), IO_ENC (R62.1)
NetR65_1: STM32G431CBT6 (U5.40), IO_ENC (R65.1)
NetR66_1: STM32G431CBT6 (U5.41), IO_ENC (R66.1)
NetR69_1: STM32G431CBT6 (U5.42), IO_ENC (R69.1)
SERIAL_N: STM32G431CBT6 (U5.43), RS485_block (R46.1)
SERIAL_P: STM32G431CBT6 (U5.44), RS485_block (R44.1)